# EAGLE design Discharge and Charge Relay Board (EAGLE 7.1.0)
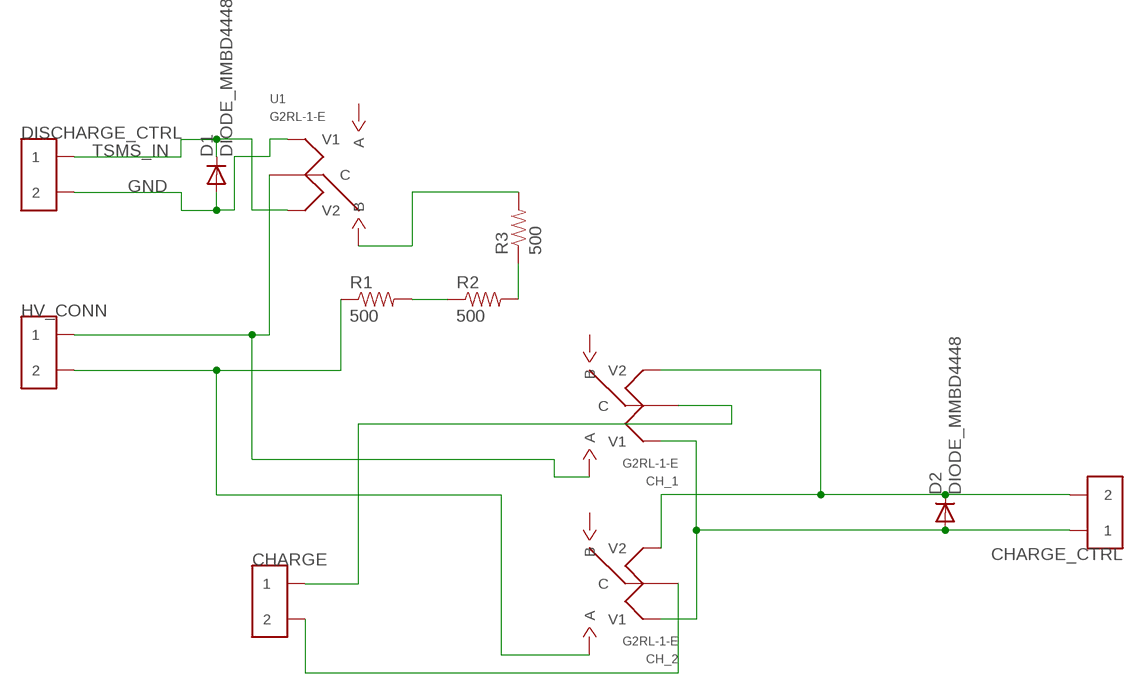
[diagram p0: schematic, sheet 1]

## Parts
CH_1  G2RL-1-E  [G2RL-1-E_RELAY]
CH_2  G2RL-1-E  [G2RL-1-E_RELAY]
CHARGE  CONN_2  [CONNECTOR_2]
CHARGE_CTRL  CONN_2  [CONNECTOR_2]
D1  DIODE_MMBD4448  [SOT-23-3]
D2  DIODE_MMBD4448  [SOT-23-3]
DISCHARGE_CTRL  CONN_2  [CONNECTOR_2]
HV_CONN  CONN_2  [CONNECTOR_2]
R1  500  FS20SERIES  [VISHAY_FS20W_RES]
R2  500  FS20SERIES  [VISHAY_FS20W_RES]
R3  500  FS20SERIES  [VISHAY_FS20W_RES]
U1  G2RL-1-E  [G2RL-1-E_RELAY]

## Nets
GND: D1.P$2(A) DISCHARGE_CTRL.3 DISCHARGE_CTRL.4 U1.P$1(V1)
N$1: CH_1.P$8(V2) CH_2.P$8(V2) CHARGE_CTRL.3 CHARGE_CTRL.4 D2.P$1(C)
N$2: CH_1.P$1(V1) CH_2.P$1(V1) CHARGE_CTRL.1 CHARGE_CTRL.2 D2.P$2(A)
N$3: R3.P$2 U1.P$2(B) U1.P$7(B)
N$6: CH_1.P$4(A) CH_1.P$5(A) HV_CONN.1 HV_CONN.2 U1.P$3(C) U1.P$6(C)
N$7: CH_2.P$4(A) CH_2.P$5(A) HV_CONN.3 HV_CONN.4 R1.P$1
N$8: CH_1.P$3(C) CH_1.P$6(C) CHARGE.1 CHARGE.2
N$9: CH_2.P$3(C) CH_2.P$6(C) CHARGE.3 CHARGE.4
N$10: R1.P$2 R2.P$1
N$11: R2.P$2 R3.P$1
TSMS_IN: D1.P$1(C) DISCHARGE_CTRL.1 DISCHARGE_CTRL.2 U1.P$8(V2)
Unconnected: CH_1.P$2(B) CH_1.P$7(B) CH_2.P$2(B) CH_2.P$7(B) U1.P$4(A) U1.P$5(A)

## Library data of the parts
CH_1 CH_2 U1 = formula electric:G2RL-1-E: G2RL-1-E SPDT Relay, 16A, Digikey: Z2834-ND; COIL: DC 12
CHARGE CHARGE_CTRL DISCHARGE_CTRL HV_CONN = formula electric:CONN_2
D1 D2 = formula electric:DIODE_MMBD4448
R1-R3 = formula electric:FS20SERIES: Digikey FS20-{R}

## Board
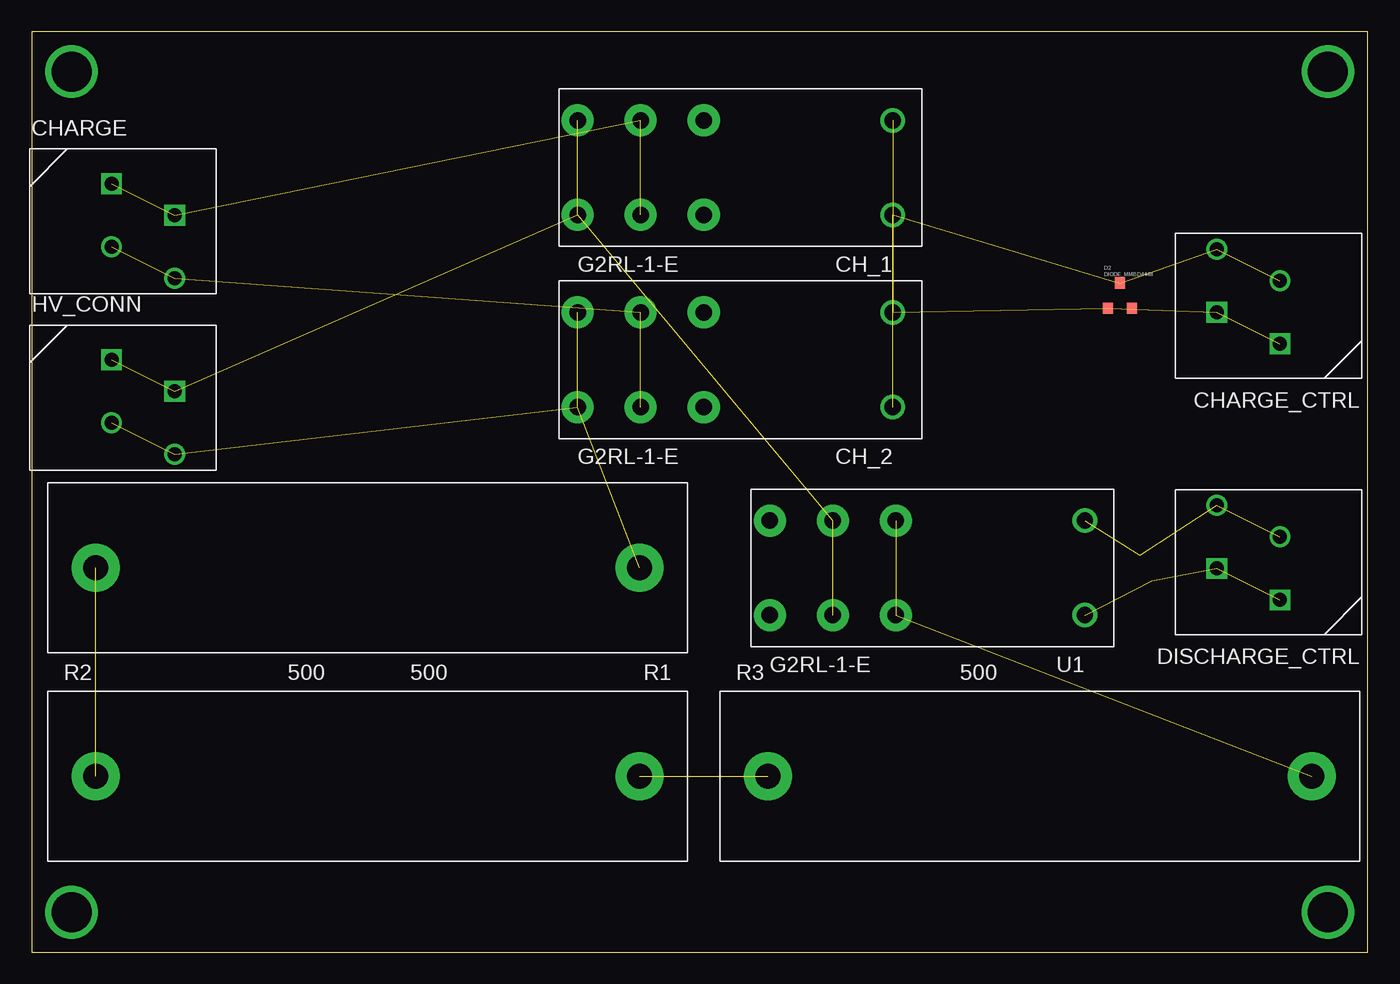
[diagram p1: board, top side]
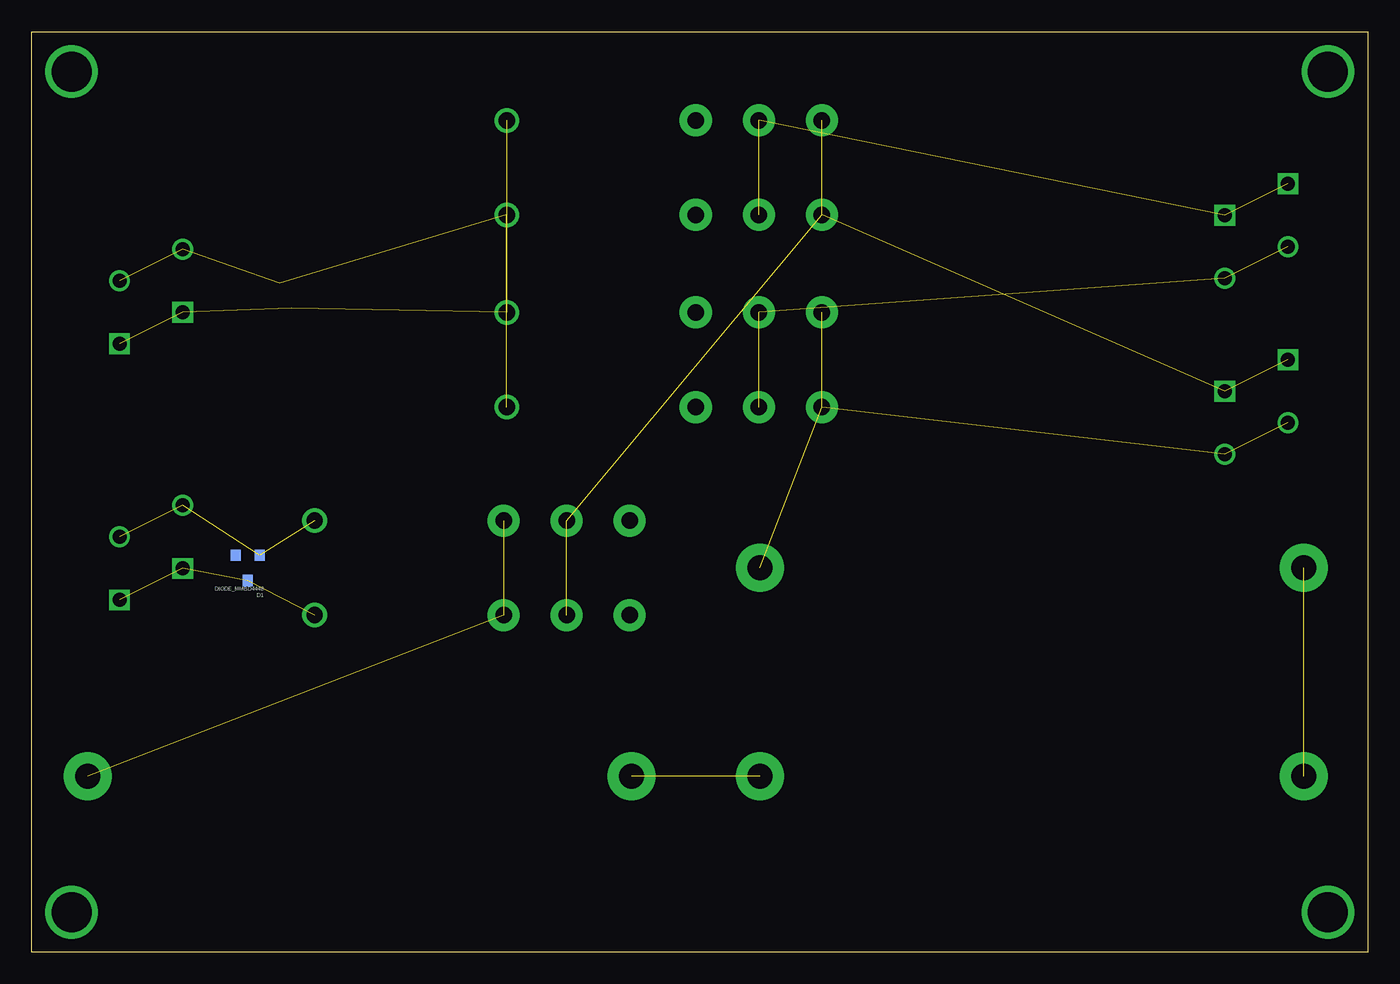
[diagram p2: board, bottom side, seen from below]

Size 106.05 x 73.03 mm. Coordinates in mm from the lower left corner, seen from the top.
Outline: 0,0 106.05,0 106.05,73.03 0,73.03 0,0
Copper layers (1*16): Top 0.035mm / dielectric 1.5mm / Bottom 0.035mm
Design rules "default": minimum track width 10mil, minimum drill 24mil, track to track 8mil, track to pad 8mil, pad to pad 8mil, via to via 8mil, smd to smd 8mil, copper to edge 40mil, drill to drill 8mil, minimum pad ring 10mil, minimum via ring 8mil, stop-mask expansion 4mil, vias tented up to drill 0mil, thermal gap 10mil

### Footprints (pad centres in the part's own frame; a part is rotated, then mirrored left to right if it is on the bottom)
G2RL-1-E_RELAY = drill 1.3: P$1 -15,-3.75; P$8 -15,3.75 | drill 1.3 pad 2.54: P$2 0,-3.75; P$3 5,-3.75; P$4 10,-3.75; P$5 10,3.75; P$6 5,3.75; P$7 0,3.75
CONNECTOR_2 = drill 1.1 square: 1 0,0; 2 2.5,5 | drill 1.1: 3 5,0; 4 7.5,5
SOT-23-3 = smd 0.8 x 0.9: P$1 0,1; P$2 -0.95,-1; P$3 0.95,-1
VISHAY_FS20W_RES = drill 1.981 pad 3.81: P$1 -21.59,0; P$2 21.59,0

### Placement (x,y rotation side)
CH_1  53.34,62.23 180 top
CH_2  53.34,46.99 180 top
CHARGE  6.35,60.96 270 top
CHARGE_CTRL  99.06,48.26 90 top
D1  88.9,30.48 180 bottom
D2  86.36,52.07 0 top
DISCHARGE_CTRL  99.06,27.94 90 top
HV_CONN  6.35,46.99 270 top
R1  26.67,30.48 180 top
R2  26.67,13.97 0 top
R3  80.01,13.97 0 top
U1  68.58,30.48 180 top

### Tracks (layer width: path | path; a pad name or v marks a point on that pad's centre or on a via)
GND  (3 unrouted)
N$1  (4 unrouted)
N$2  (4 unrouted)
N$3  (2 unrouted)
N$4  (via drill 3.17)
  other vias: 3.17,69.85
N$5  (via drill 3.17)
  other vias: 3.17,3.17
N$6  (5 unrouted)
N$7  (4 unrouted)
N$8  (3 unrouted)
N$9  (3 unrouted)
N$10  (1 unrouted)
N$11  (1 unrouted)
N$12  (via drill 3.17)
  other vias: 102.87,3.17
N$13  (via drill 3.17)
  other vias: 102.87,69.85
TSMS_IN  (3 unrouted)